# Altium schematic sheet PE.SchDoc
size A; SheetNumber: 1; SheetTotal: 1
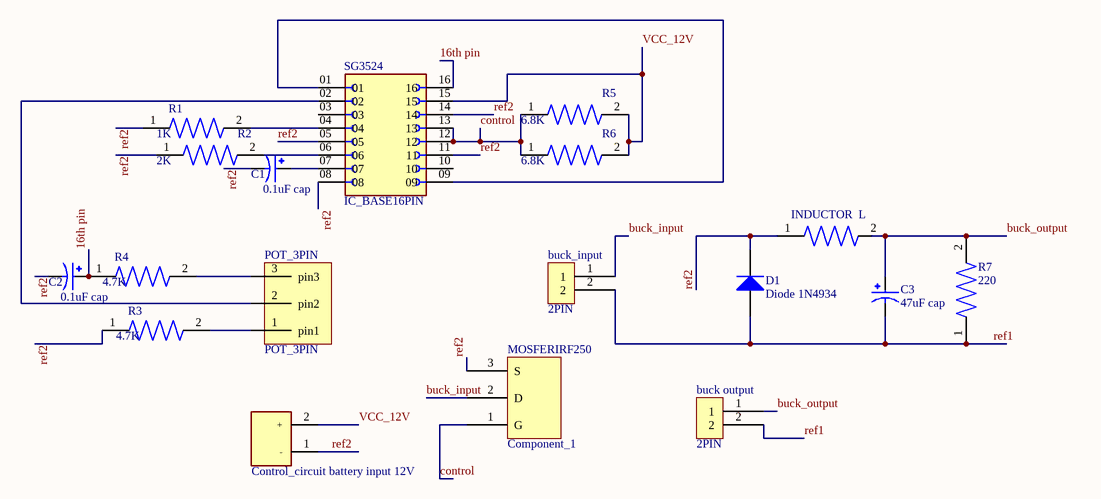
[diagram p0: PE.SchDoc]

## Parts
buck_input  2PIN  [pin2]
buck_output  2PIN  [pin2]
C1  0.1uF cap  [4.7UF CAP]
C2  0.1uF cap  [4.7UF CAP]
C3  47uF cap  [4.7UF CAP]
Control_circuit_battery_input_12V  HEADER, 2 PINS  [XT60 MALE]  (value not drawn)
D1  Diode 1N4934  [DO-41]
L  INDUCTOR  [RESAD700W45L350D185]
MOSFERIRF250  Component_1  [mosfetIRF250]
POT_3PIN  POT_3PIN  [pot_3pin]
R1  1K  [RESAD700W45L350D185]
R2  2K  [RESAD700W45L350D185]
R3  4.7K  [RESAD700W45L350D185]
R4  4.7K  [RESAD700W45L350D185]
R5  6.8K  [RESAD700W45L350D185]
R6  6.8K  [RESAD700W45L350D185]
R7  220  [RESAD700W45L350D185]
SG3524  IC_BASE16PIN  [AMPHENOL_DILB16P-223TLF]

## Nets
16th pin: C2.P R4.1 SG3524.16
buck_input: buck_input.1 MOSFERIRF250.2(D)
buck_output: buck_output.1 C3.P L.2 R7.2
control : MOSFERIRF250.1(G) R5.1 R6.1 SG3524.12 SG3524.13
ref1: buck_input.2 buck_output.2 C3.N D1.1(A) R7.1
ref2: C1.N C2.N Control_circuit_battery_input_12V.1(-) D1.2(K) L.1 MOSFERIRF250.3(S) R1.1 R2.1 R3.1 SG3524.05 SG3524.08 SG3524.11 SG3524.14
VCC_12V: Control_circuit_battery_input_12V.2(+) R5.2 R6.2 SG3524.15
NetC1_P: C1.P SG3524.07
NetPOT_3PIN_1: POT_3PIN.1(pin1) R3.2
NetPOT_3PIN_2: POT_3PIN.2(pin2) SG3524.02
NetPOT_3PIN_3: POT_3PIN.3(pin3) R4.2
NetR1_2: R1.2 SG3524.04
NetR2_2: R2.2 SG3524.06
NetSG3524_01: SG3524.01 SG3524.09

Not connected (* = marked no-connect by the designer): SG3524 03 10

## Library data of the parts
C1-C3 = 4.7uF cap: CAP ALUM 4.7UF 20% 50V RADIAL; MP: ECE-A1HKA4R7I; MF: Panasonic; Purchase-URL: https://pricing.snapeda.com/search/part/ECE-A1HKA4R7I/?ref=eda; Package: RADIAL-2 Panasonic; Value: *; SnapEDA_Link: https://www.snapeda.com/parts/ECE-A1HKA4R7I/Panasonic/view-part/2342017/?ref=snap; Availability: In Stock; Price: None; Check_prices: https://www.snapeda.com/parts/ECE-A1HKA4R7I/Panasonic/view-part/2342017/?ref=eda
Control_circuit_battery_input_12V = XT60 MALE: CONNECTOR
D1 = Diode 1N4934: 1 Amp Fast Recovery Rectifier; Published: 8-Jun-2000; LatestRevisionDate: 17-Jul-2002; LatestRevisionNote: Re-released for DXP Platform.; DatasheetVersion: 1999; PackageVersion: Aug-1999; PackageReference: DO-41; Publisher: Altium Limited; PackageDescription: Diode, Axial; Body 5.2 x 2.7 mm (LxDia. max), Lead Dia. 0.86 mm (max); Code_JEDEC: DO-204-AL; ComponentLink1Description: Manufacturer Link; ComponentLink1URL: http://www.fairchildsemi.com/; ComponentLink2Description: Datasheet; ComponentLink2URL: http://www.fairchildsemi.com/ds/1N%2F1N4934.pdf
L R1-R7 = 3-1623927-1: 1 MOhms Â±5% 0.25W, 1/4W Through Hole Resistor Axial - Carbon Film; MF: TE Connectivity; Price: None; SnapEDA_Link: https://www.snapeda.com/parts/3-1623927-1/TE+Connectivity/view-part/?ref=snap; Check_prices: https://www.snapeda.com/parts/3-1623927-1/TE+Connectivity/view-part/?ref=eda; Value: *; MP: 3-1623927-1; Package: None; Availability: In Stock
SG3524 = IC_BASE16PIN: DIP Socket, Stamped and Formed; MF: Amphenol ICC (FCI); MP: DILB16P-223TLF; Check_prices: https://www.snapeda.com/parts/DILB16P-223TLF/Amphenol+FCI/view-part/?ref=eda; Package: None; Price: None; Value: *; SnapEDA_Link: https://www.snapeda.com/parts/DILB16P-223TLF/Amphenol+FCI/view-part/?ref=snap; Availability: In Stock